# EAGLE schematic GasSensorCentralButtons_v1.0 (EAGLE 7.4.0)
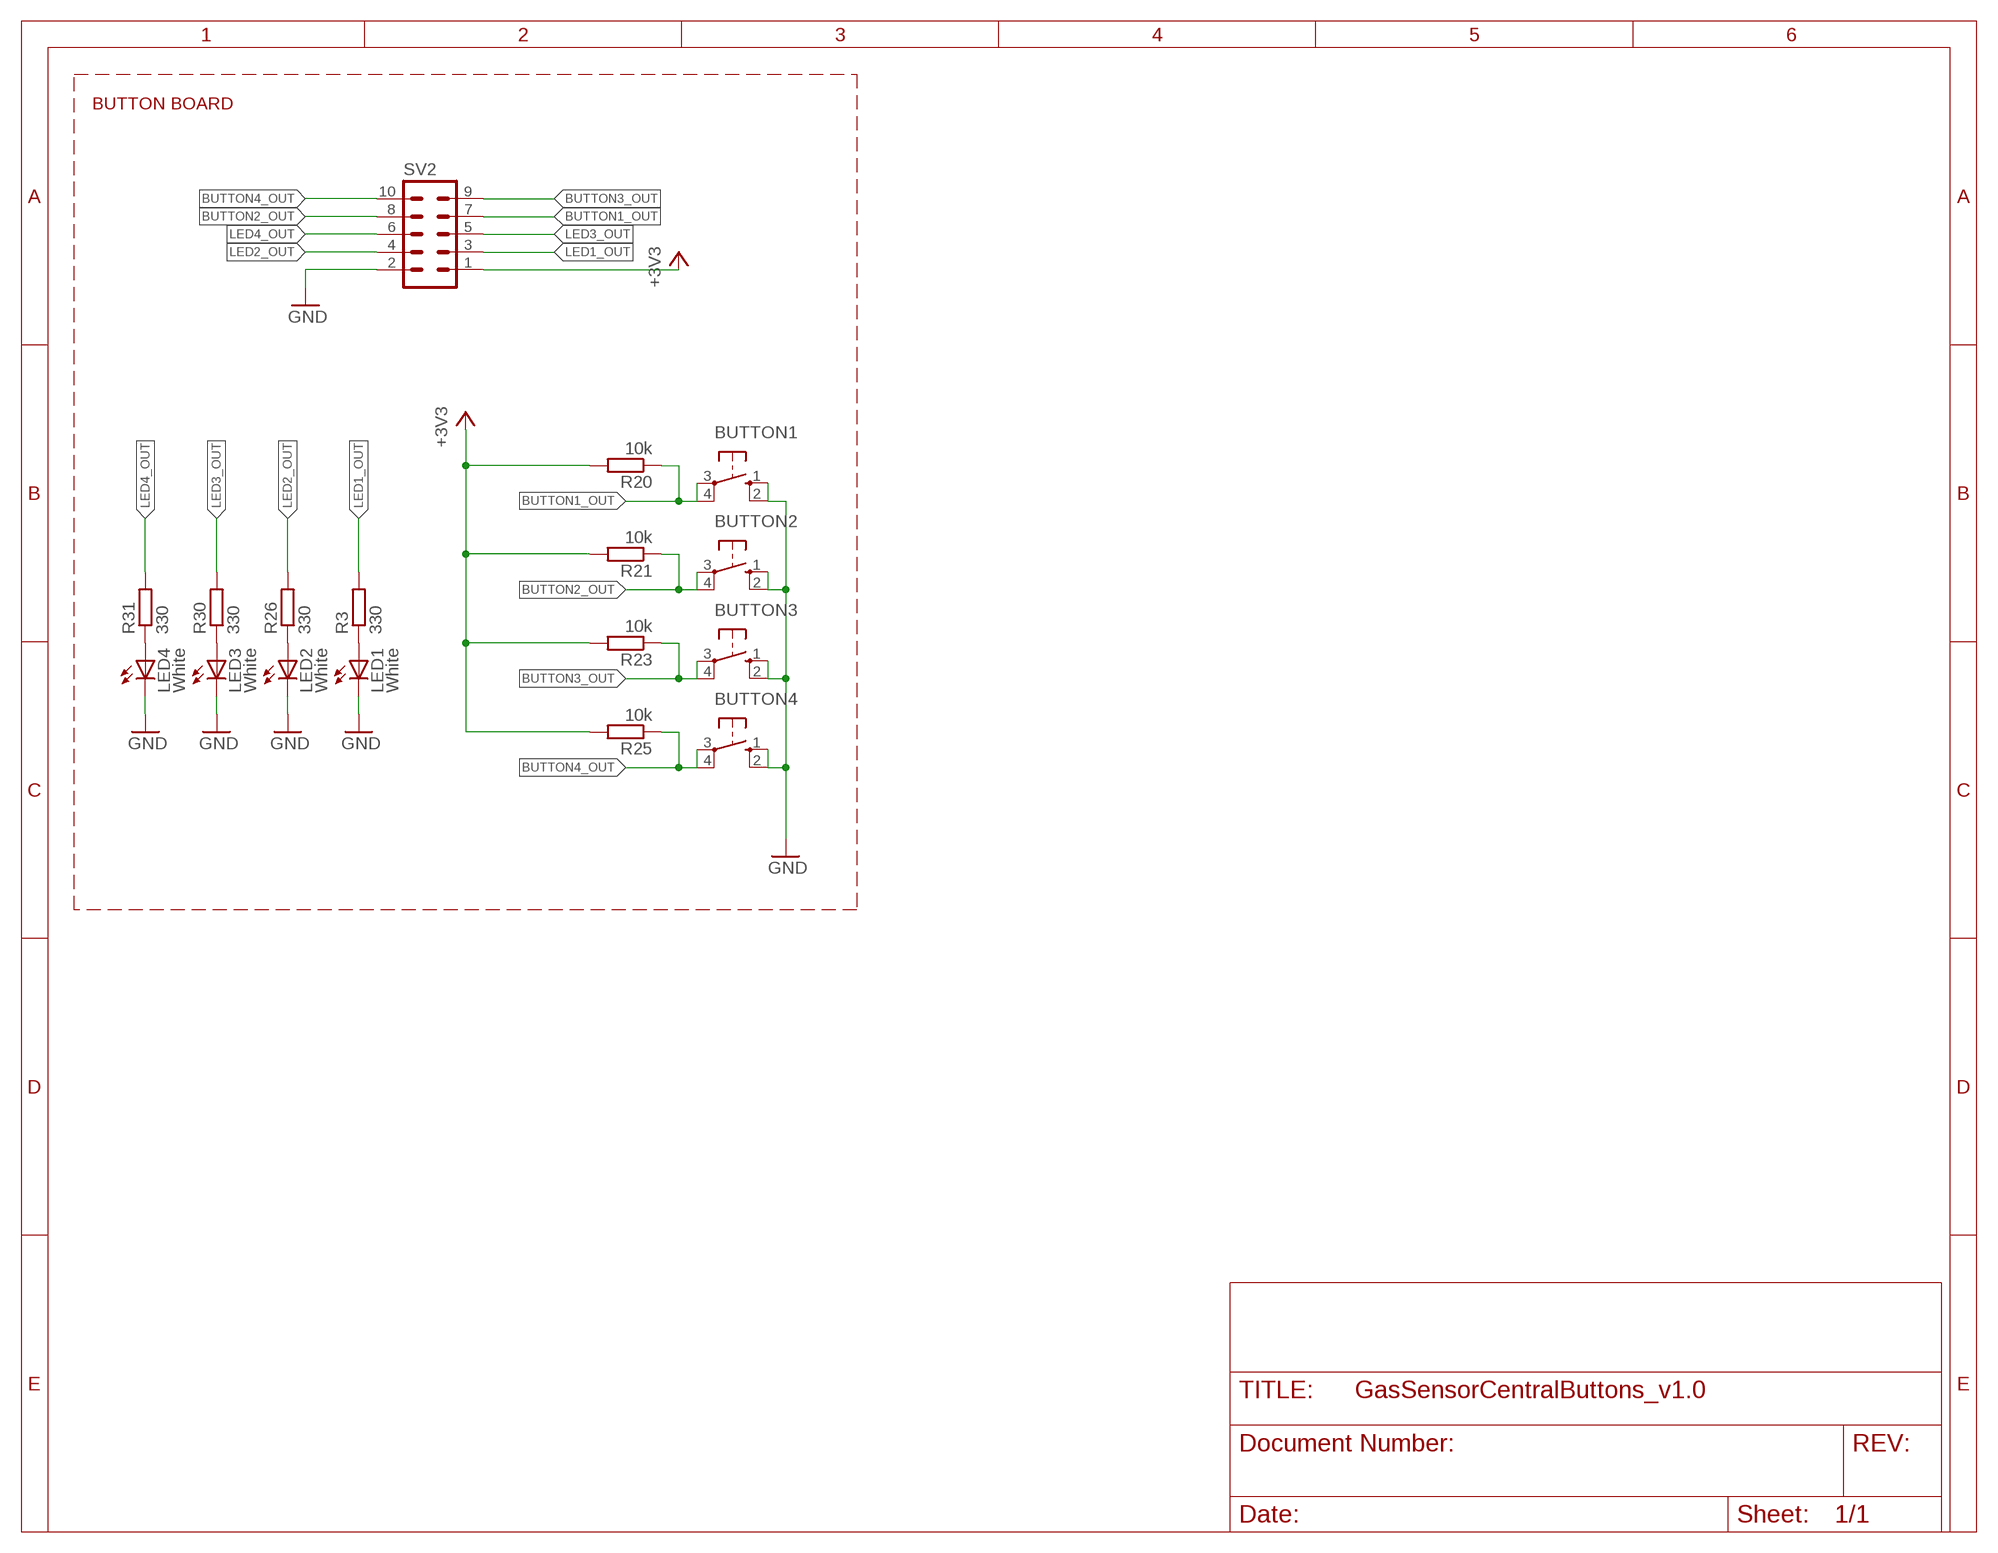
[diagram p0: schematic, sheet 1]

## Parts
BUTTON1  10-XX  [B3F-10XX]
BUTTON2  10-XX  [B3F-10XX]
BUTTON3  10-XX  [B3F-10XX]
BUTTON4  10-XX  [B3F-10XX]
LED1  White  LED3MM  [LED3MM]
LED2  White  LED3MM  [LED3MM]
LED3  White  LED3MM  [LED3MM]
LED4  White  LED3MM  [LED3MM]
R3  330  R-EU_0207/10  [0207/10]
R20  10k  R-EU_0207/10  [0207/10]
R21  10k  R-EU_0207/10  [0207/10]
R23  10k  R-EU_0207/10  [0207/10]
R25  10k  R-EU_0207/10  [0207/10]
R26  330  R-EU_0207/10  [0207/10]
R30  330  R-EU_0207/10  [0207/10]
R31  330  R-EU_0207/10  [0207/10]
SV2  ML10  [ML10]

## Nets
+3V3: R20.2 R21.2 R23.2 R25.2 SV2.1
BUTTON1_OUT: BUTTON1.3(P) BUTTON1.4(P1) R20.1 SV2.7
BUTTON2_OUT: BUTTON2.3(P) BUTTON2.4(P1) R21.1 SV2.8
BUTTON3_OUT: BUTTON3.3(P) BUTTON3.4(P1) R23.1 SV2.9
BUTTON4_OUT: BUTTON4.3(P) BUTTON4.4(P1) R25.1 SV2.10
GND: BUTTON1.1(S) BUTTON1.2(S1) BUTTON2.1(S) BUTTON2.2(S1) BUTTON3.1(S) BUTTON3.2(S1) BUTTON4.1(S) BUTTON4.2(S1) LED1.K(C) LED2.K(C) LED3.K(C) LED4.K(C) SV2.2
LED1_OUT: R3.2 SV2.3
LED2_OUT: R26.2 SV2.4
LED3_OUT: R30.2 SV2.5
LED4_OUT: R31.2 SV2.6
N$5: LED1.A R3.1
N$18: LED2.A R26.1
N$19: LED3.A R30.1
N$20: LED4.A R31.1

## Notes on the sheet
- BUTTON BOARD

## Library data of the parts
BUTTON1-BUTTON4 = switch-omron:10-XX: OMRON SWITCH; MPN: B3F-1000; OC_FARNELL: 176432; OC_NEWARK: 36M3542
LED1-LED4 = led:LED: LED OSRAM: - CHIPLED LG R971, LG N971, LY N971, LG Q971, LY Q971, LO R971, LY R971 LH N974, LH R974 LS Q976, LO Q976, LY Q976 LO Q996 - Hyper CHIPLED LW Q18S LB Q993, LB Q99A, LB R99A - SideLED LS A670, LO A670, LY A670, LG A670, LP A670 LB A673, LV A673, LT A673, LW A673 LH A674 LY A675 LS A676, LA A676, LO A676, LY A676, LW A676 LS A679, LY A679, LG A679 - Hyper Micro SIDELED® LS Y876, LA Y876, LO Y876, LY Y876 LT Y87S - SmartLED LW L88C, LW L88S LB L89C, LB L89S, LG L890 LS L89K, LO L89K, LY L89K LS L896, LA L896, LO L896, LY L896 - TOPLED LS T670, LO T670, LY T670, LG T670, LP T670 LSG T670, LSP T670, LSY T670, LOP T670, LYG T670 LG T671, LOG T671, LSG T671 LB T673, LV T673, LT T673, LW T673 LH T674 LS T676, LA T676, LO T676, LY T676, LB T676, LH T676, LSB T676, LW T676 LB T67C, LV T67C, LT T67C, LS T67K, LO T67K, LY T67K, LW E67C LS E67B, LA E67B, LO E67B, LY E67B, LB E67C, LV E67C, LT E67C LW T67C LS T679, LY T679, LG T679 LS T770, LO T770, LY T770, LG T770, LP T770 LB T773, LV T773, LT T773, LW T773 LH T774 LS E675, LA E675, LY E675, LS T675 LS T776, LA T776, LO T776, LY T776, LB T776 LHGB T686 LT T68C, LB T68C - Hyper Mini TOPLED® LB M676 - Mini TOPLED Santana® LG M470 LS M47K, LO M47K, LY M47K Source: http://www.osram.convergy.de LUXEON: - LUMILED® LXK2-PW12-R00, LXK2-PW12-S00, LXK2-PW14-U00, LXK2-PW14-V00 LXK2-PM12-R00, LXK2-PM12-S00, LXK2-PM14-U00 LXK2-PE12-Q00, LXK2-PE12-R00, LXK2-PE12-S00, LXK2-PE14-T00, LXK2-PE14-U00 LXK2-PB12-K00, LXK2-PB12-L00, LXK2-PB12-M00, LXK2-PB14-N00, LXK2-PB14-P00, LXK2-PB14-Q00 LXK2-PR12-L00, LXK2-PR12-M00, LXK2-PR14-Q00, LXK2-PR14-R00 LXK2-PD12-Q00, LXK2-PD12-R00, LXK2-PD12-S00 LXK2-PH12-R00, LXK2-PH12-S00 LXK2-PL12-P00, LXK2-PL12-Q00, LXK2-PL12-R00 Source: www.luxeon.com KINGBRIGHT: KA-3528ASYC Source: www.kingbright.com
R3 R20 R21 R23 R25 R26 R30 R31 = rcl:R-EU_: RESISTOR, European symbol
SV2 = con-harting-ml:ML10: HARTING; OC_FARNELL: unknown; OC_NEWARK: unknown